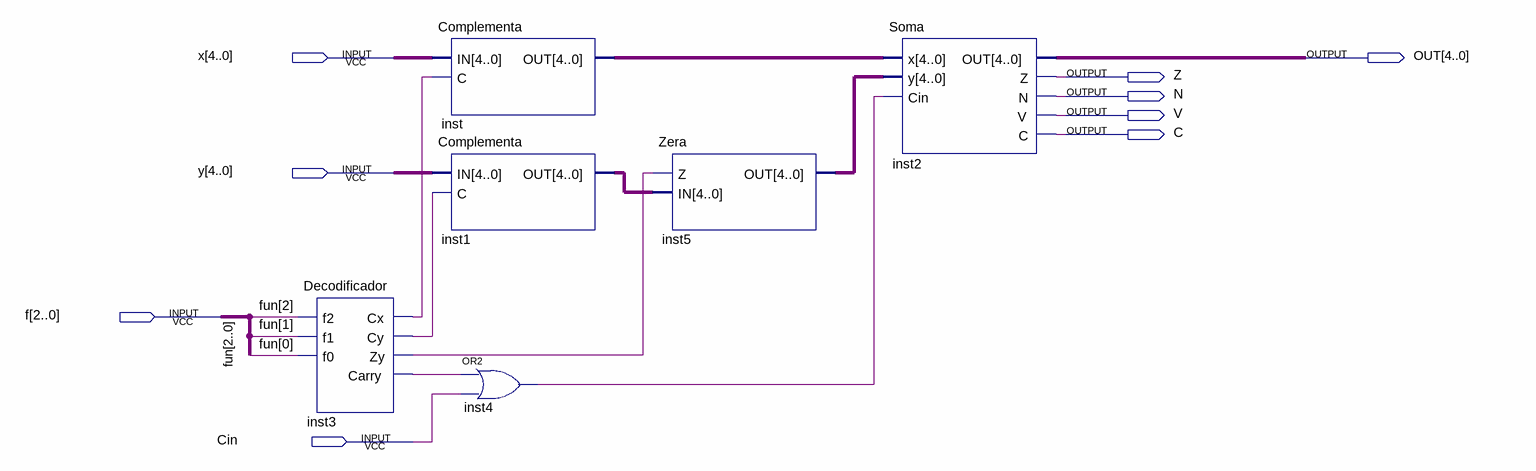
[diagram p0: schematic sheet]
// Quartus schematic ULA.bdf as structural Verilog: 6 symbols, 9 pins
module ULA (
  input  [4:0] x,
  input  [4:0] y,
  input  [2:0] f,
  input  Cin,
  output [4:0] OUT,
  output Z,
  output N,
  output V,
  output C
);

  wire inst3_carry, inst3_cx, inst3_cy, inst3_zy, inst4_out;
  wire [4:0] inst1_out, inst5_out, inst_out;

  Decodificador inst3 (
    .f2(f[2]), .f1(f[1]), .f0(f[0]), .Cx(inst3_cx), .Cy(inst3_cy), .Zy(inst3_zy), .Carry(inst3_carry));
  Complementa inst (.IN(x), .C(inst3_cx), .OUT(inst_out));
  Complementa inst1 (.IN(y), .C(inst3_cy), .OUT(inst1_out));
  or inst4 (inst4_out, inst3_carry, Cin);
  Zera inst5 (.Z(inst3_zy), .IN(inst1_out), .OUT(inst5_out));
  Soma inst2 (.x(inst_out), .y(inst5_out), .Cin(inst4_out), .OUT(OUT), .Z(Z), .N(N), .V(V), .C(C));

  // Other names for the same wires on the sheet: fun[2:0] = f
endmodule
